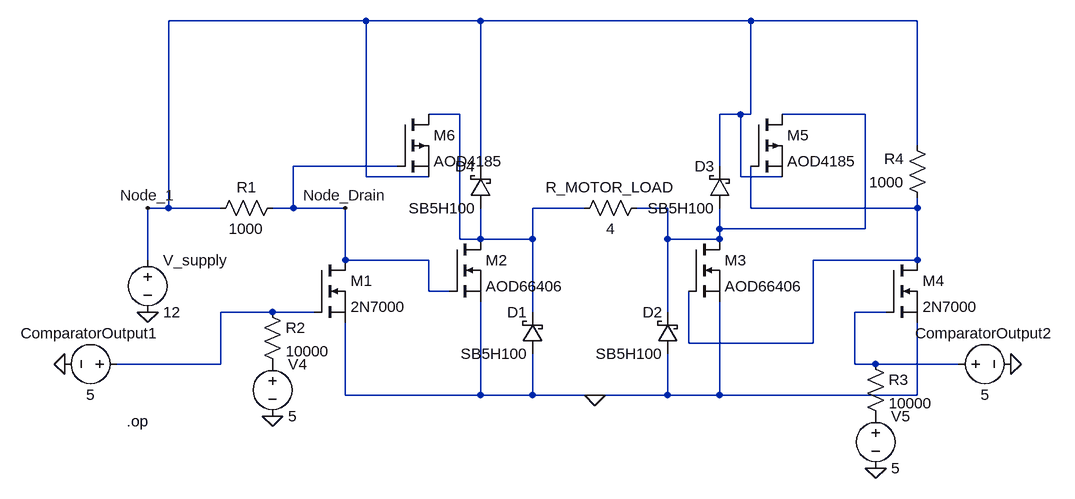
[diagram p0: schematic H_BRIDGE_MOSFET_CIRCUIT_ANALYSIS_V2.asc]
H_BRIDGE_MOSFET_CIRCUIT_ANALYSIS_V2.asc, the LTspice schematic file:
Version 4
SHEET 1 1420 752
WIRE 288 -144 -16 -144
WIRE 464 -144 288 -144
WIRE 880 -144 464 -144
WIRE 1136 -144 880 -144
WIRE 432 0 384 0
WIRE 864 0 832 0
WIRE 880 0 880 -144
WIRE 880 0 864 0
WIRE 1056 0 928 0
WIRE 1136 48 1136 -144
WIRE 336 80 176 80
WIRE 464 80 464 -144
WIRE 832 80 832 0
WIRE 288 96 288 -144
WIRE 384 96 288 96
WIRE 864 96 864 0
WIRE 928 96 864 96
WIRE -16 144 -16 -144
WIRE -16 144 -48 144
WIRE 64 144 -16 144
WIRE 176 144 176 80
WIRE 176 144 144 144
WIRE 256 144 176 144
WIRE 624 144 544 144
WIRE 752 144 704 144
WIRE 880 144 880 80
WIRE 1136 144 1136 128
WIRE 1136 144 880 144
WIRE 832 176 832 144
WIRE 1056 176 1056 0
WIRE 1056 176 832 176
WIRE 432 192 432 0
WIRE 464 192 464 144
WIRE 464 192 432 192
WIRE 544 192 544 144
WIRE 544 192 464 192
WIRE 752 192 752 144
WIRE 832 192 832 176
WIRE 832 192 752 192
WIRE -48 224 -48 144
WIRE 256 224 256 144
WIRE 384 224 256 224
WIRE 1136 224 1136 144
WIRE 1136 224 976 224
WIRE 384 272 384 224
WIRE 416 272 384 272
WIRE 144 304 64 304
WIRE 208 304 144 304
WIRE 544 304 544 192
WIRE 752 304 752 192
WIRE 1088 304 1040 304
WIRE 784 352 784 272
WIRE 976 352 976 224
WIRE 976 352 784 352
WIRE 64 384 64 304
WIRE 64 384 -96 384
WIRE 1040 384 1040 304
WIRE 1072 384 1040 384
WIRE 1200 384 1072 384
WIRE 256 432 256 320
WIRE 464 432 464 288
WIRE 464 432 256 432
WIRE 544 432 544 368
WIRE 544 432 464 432
WIRE 640 432 544 432
WIRE 752 432 752 368
WIRE 752 432 640 432
WIRE 832 432 832 288
WIRE 832 432 752 432
WIRE 1136 432 1136 320
WIRE 1136 432 832 432
FLAG -48 304 0
FLAG -48 144 Node_1
FLAG 256 144 Node_Drain
FLAG -176 384 0
FLAG 1280 384 0
FLAG 640 432 0
FLAG 144 464 0
FLAG 1072 544 0
DATAFLAG 368 224 ""
DATAFLAG 912 352 ""
DATAFLAG 896 144 ""
DATAFLAG 208 80 ""
DATAFLAG 544 144 ""
DATAFLAG 752 160 ""
DATAFLAG 752 160 ""
DATAFLAG 672 -144 ""
DATAFLAG 832 432 ""
SYMBOL voltage -48 208 R0
WINDOW 123 0 0 Left 0
WINDOW 39 0 0 Left 0
SYMATTR InstName V_supply
SYMATTR Value 12
SYMBOL res 160 128 R90
WINDOW 0 0 56 VBottom 2
WINDOW 3 32 56 VTop 2
SYMATTR InstName R1
SYMATTR Value 1000
SYMBOL nmos 208 224 R0
SYMATTR InstName M1
SYMATTR Value 2N7000
SYMBOL nmos 416 192 R0
SYMATTR InstName M2
SYMATTR Value AOD66406
SYMBOL nmos 784 192 R0
SYMATTR InstName M3
SYMATTR Value AOD66406
SYMBOL nmos 1088 224 R0
SYMATTR InstName M4
SYMATTR Value 2N7000
SYMBOL schottky 560 368 R180
WINDOW 0 24 64 Left 2
WINDOW 3 24 0 Left 2
SYMATTR InstName D1
SYMATTR Value SB5H100
SYMATTR Description Diode
SYMATTR Type diode
SYMBOL pmos 880 0 R0
SYMATTR InstName M5
SYMATTR Value AOD4185
SYMBOL res 720 128 R90
WINDOW 0 0 56 VBottom 2
WINDOW 3 32 56 VTop 2
SYMATTR InstName R_MOTOR_LOAD
SYMATTR Value 4
SYMBOL schottky 768 368 R180
WINDOW 0 24 64 Left 2
WINDOW 3 24 0 Left 2
SYMATTR InstName D2
SYMATTR Value SB5H100
SYMATTR Description Diode
SYMATTR Type diode
SYMBOL schottky 848 144 R180
WINDOW 0 24 64 Left 2
WINDOW 3 24 0 Left 2
SYMATTR InstName D3
SYMATTR Value SB5H100
SYMATTR Description Diode
SYMATTR Type diode
SYMBOL schottky 480 144 R180
WINDOW 0 24 64 Left 2
WINDOW 3 24 0 Left 2
SYMATTR InstName D4
SYMATTR Value SB5H100
SYMATTR Description Diode
SYMATTR Type diode
SYMBOL pmos 336 0 R0
SYMATTR InstName M6
SYMATTR Value AOD4185
SYMBOL res 1152 144 R180
WINDOW 0 36 76 Left 2
WINDOW 3 36 40 Left 2
SYMATTR InstName R4
SYMATTR Value 1000
SYMBOL voltage -80 384 R90
WINDOW 0 -32 56 VBottom 2
WINDOW 3 32 56 VTop 2
WINDOW 123 0 0 Left 0
WINDOW 39 0 0 Left 0
SYMATTR InstName ComparatorOutput1
SYMATTR Value 5
SYMBOL voltage 1184 384 R270
WINDOW 0 32 56 VTop 2
WINDOW 3 -32 56 VBottom 2
WINDOW 123 0 0 Left 0
WINDOW 39 0 0 Left 0
SYMATTR InstName ComparatorOutput2
SYMATTR Value 5
SYMBOL res 128 288 R0
SYMATTR InstName R2
SYMATTR Value 10000
SYMBOL voltage 144 368 R0
WINDOW 123 0 0 Left 0
WINDOW 39 0 0 Left 0
SYMATTR InstName V4
SYMATTR Value 5
SYMBOL res 1056 368 R0
SYMATTR InstName R3
SYMATTR Value 10000
SYMBOL voltage 1072 448 R0
WINDOW 123 0 0 Left 0
WINDOW 39 0 0 Left 0
SYMATTR InstName V5
SYMATTR Value 5
TEXT -80 472 Left 2 !.op

The netlist it stands for:
* H_BRIDGE_MOSFET_CIRCUIT_ANALYSIS_V2.asc
V_supply Node_1 0 12
R1 Node_Drain Node_1 1000
M1 Node_Drain N004 0 0 2N7000
M2 N001 Node_Drain 0 0 AOD66406
M3 N002 N003 0 0 AOD66406
M4 N003 N005 0 0 2N7000
D1 0 N001 SB5H100
M5 N002 N003 Node_1 Node_1 AOD4185
R_MOTOR_LOAD N002 N001 4
D2 0 N002 SB5H100
D3 N002 Node_1 SB5H100
D4 N001 Node_1 SB5H100
M6 N001 Node_Drain Node_1 Node_1 AOD4185
R4 N003 Node_1 1000
V§ComparatorOutput1 N004 0 5
V§ComparatorOutput2 N005 0 5
R2 N004 P001 10000
V4 P001 0 5
R3 N005 P002 10000
V5 P002 0 5
.model D D
.lib standard.dio
.model NMOS NMOS
.model PMOS PMOS
.lib standard.mos
.op
.backanno
.end